# EAGLE design dss_v3 (EAGLE 9.6.0)
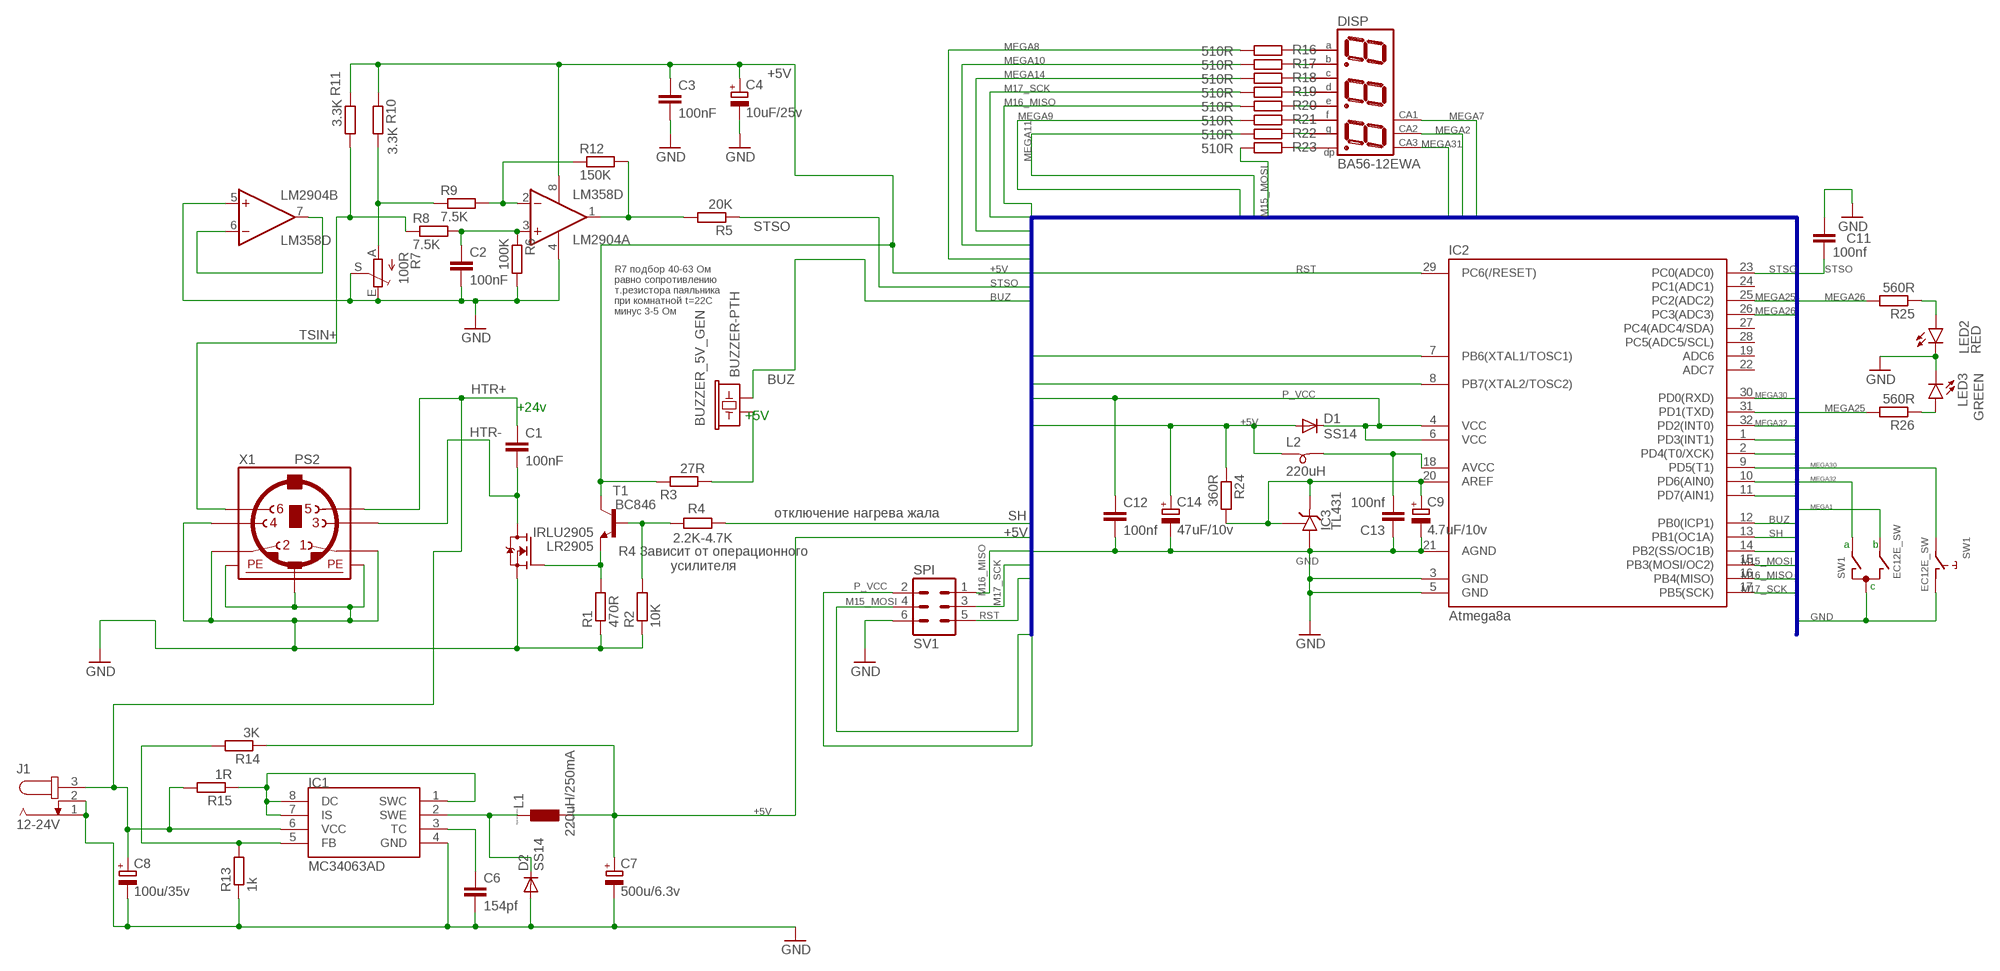
[diagram p0: schematic, sheet 1]

## Parts
BUZZER_5V_GEN  BUZZER-PTH  [BUZZER-12MM]
C1  100nF  C-EUC0805  [C0805]
C2  100nF  C-EUC0805  [C0805]
C3  100nF  C-EUC0805  [C0805]
C4  10uF/25v  CPOL-EUCT3528  [CT3528]
C6  154pf  C-EUC0805  [C0805]
C7  500u/6.3v  CPOL-EUE3.5-8  [E3,5-8]
C8  100u/35v  CPOL-EUE3.5-8  [E3,5-8]
C9  4.7uF/10v  CPOL-EUCT3216  [CT3216]
C11  100nf  C-EUC0805  [C0805]
C12  100nf  C-EUC0805  [C0805]
C13  100nf  C-EUC0805  [C0805]
C14  47uF/10v  CPOL-EUCT3528  [CT3528]
D1  SS14  DIODE-DO214AC  [DO214AC]
D2  SS14  DIODE-DO214AC  [DO214AC]
DISP  BA56-12EWA  [BX56-12]
IC1  MC34063AD  [SOIC8]
IC2  Atmega8a  ATMEGA8-AU  [TQFP32-08]
IC3  TL431  TL431CLPSOT23  [SOT23]
IRLU2905  LR2905  SPW47N60S5  [TO252]
J1  12-24V  JACK-PLUG0  [SPC4077]
L1  220uH/250mA  LL4532P  [L4532P]
L2  220uH  SM-B5  [SM-B5]
LED2  RED  LEDCHIP-LED0805  [CHIP-LED0805]
LED3  GREEN  LEDCHIP-LED0805  [CHIP-LED0805]
LM2904  LM358D  [SO08]
R1  470R  R-EU_R0805  [R0805]
R2  10K  R-EU_R0805  [R0805]
R3  27R  R-EU_R0805  [R0805]
R4  2.2K-4.7K  R-EU_R0805  [R0805]
R5  20K  R-EU_R0805  [R0805]
R6  100K  R-EU_R0805  [R0805]
R7  100R  TRIM_EU-B25P  [B25P]
R8  7.5K  R-EU_R0805  [R0805]
R9  7.5K  R-EU_R0805  [R0805]
R10  3.3K  R-EU_R0805  [R0805]
R11  3.3K  R-EU_R0805  [R0805]
R12  150K  R-EU_R0805  [R0805]
R13  1k  R-EU_R0805  [R0805]
R14  3K  R-EU_R0805  [R0805]
R15  1R  R-EU_R0805  [R0805]
R16  510R  R-EU_R0805  [R0805]
R17  510R  R-EU_R0805  [R0805]
R18  510R  R-EU_R0805  [R0805]
R19  510R  R-EU_R0805  [R0805]
R20  510R  R-EU_R0805  [R0805]
R21  510R  R-EU_R0805  [R0805]
R22  510R  R-EU_R0805  [R0805]
R23  510R  R-EU_R0805  [R0805]
R24  360R  R-EU_R0805  [R0805]
R25  560R  R-EU_R0805  [R0805]
R26  560R  R-EU_R0805  [R0805]
SV1  SPI  ML6  [ML6]
SW1  EC12E_SW  [ALPS_EC12E_SW]
T1  BC846  [SOT23]
X1  PS2  MINI_DIN_6  [M_DIN6]

## Nets
+5V: C3.1 C4.+ C7.+ C14.+ D1.A L1.2 L2.1 LM2904.8(P:V+) R3.2 R10.1 R11.1 R14.1 R24.1 T1.3(C)
BUZ: BUZZER_5V_GEN.- IC2.12(PB0(ICP1))
GND: C2.2 C3.2 C4.- C6.2 C7.- C8.- C9.- C11.1 C12.2 C13.1 C14.- D2.A IC1.4(GND) IC2.3(GND) IC2.5(GND) IC2.21(AGND) IC3.3(A) IRLU2905.3(S) J1.1 J1.2 LED2.C LED3.C LM2904.4(P:V-) LM2904.5(B:+IN) R1.1 R2.1 R6.2 R7.E R7.S R13.1 SV1.6 SW1.C SW1.D X1.1 X1.2 X1.5 X1.SH1(PE1) X1.SH2(PE2) X1.SH3(PE3)
HTR+: C1.1 C8.+ IC1.6(VCC) J1.3 R15.2 X1.6
HTR-: C1.2 IRLU2905.4(D) X1.3
M15_MOSI: IC2.15(PB3(MOSI/OC2)) R23.2 SV1.4
M16_MISO: IC2.16(PB4(MISO)) R20.2 SV1.1
M17_SCK: IC2.17(PB5(SCK)) R19.2 SV1.3
MEGA1: IC2.1(PD3(INT1)) SW1.B
MEGA2: DISP.9(CA) IC2.2(PD4(T0/XCK))
MEGA7: DISP.12(CA) IC2.7(PB6(XTAL1/TOSC1))
MEGA8: IC2.8(PB7(XTAL2/TOSC2)) R16.2
MEGA9: IC2.9(PD5(T1)) R21.2
MEGA10: IC2.10(PD6(AIN0)) R17.2
MEGA11: IC2.11(PD7(AIN1)) R22.2
MEGA14: IC2.14(PB2(SS/OC1B)) R18.2
MEGA25: IC2.25(PC2(ADC2)) R26.2
MEGA26: IC2.26(PC3(ADC3)) R25.2
MEGA30: IC2.30(PD0(RXD)) SW1.E
MEGA31: DISP.8(CA) IC2.31(PD1(TXD))
MEGA32: IC2.32(PD2(INT0)) SW1.A
N$1: DISP.11(A) R16.1
N$2: LED2.A R25.1
N$3: DISP.7(B) R17.1
N$4: DISP.4(C) R18.1
N$5: C9.+ IC2.20(AREF) IC3.1(C) IC3.2(R) R24.2
N$6: LM2904.1(A:OUT) R5.2 R12.2
N$7: LM2904.6(B:-IN) LM2904.7(B:OUT)
N$8: LM2904.2(A:-IN) R9.2 R12.1
N$9: R7.A R9.1 R10.2
N$10: IRLU2905.1(G) R1.2 T1.2(E)
N$11: C2.1 LM2904.3(A:+IN) R6.1 R8.2
N$12: DISP.2(D) R19.1
N$13: R2.2 R4.2 T1.1(B)
N$14: DISP.1(E) R20.1
N$15: LED3.A R26.1
N$16: BUZZER_5V_GEN.+ R3.1
N$18: IC1.5(FB) R13.2 R14.2
N$19: DISP.10(F) R21.1
N$20: DISP.5(G) R22.1
N$21: DISP.3(DP) R23.1
N$22: IC1.1(SWC) IC1.7(IS) IC1.8(DC) R15.1
N$23: C13.2 IC2.18(AVCC) L2.2
N$25: D2.C IC1.2(SWE) L1.1
N$26: C6.1 IC1.3(TC)
P_VCC: C12.1 D1.C IC2.4(VCC) IC2.6(VCC) SV1.2
RST: IC2.29(PC6(/RESET)) SV1.5
SH: IC2.13(PB1(OC1A)) R4.1
STSO: C11.2 IC2.23(PC0(ADC0)) R5.1
TSIN+: R8.1 R11.2 X1.8
Unconnected: IC2.19(ADC6) IC2.22(ADC7) IC2.24(PC1(ADC1)) IC2.27(PC4(ADC4/SDA)) IC2.28(PC5(ADC5/SCL)) SW1.GND1(G) SW1.GND2(G)

## Buses
MEGA[1..32],STSO,BUZ,SH,+5V,GND,AREF,RST,MOSI,SCK,MISO,P_VCC,M15_MOSI,M16_MISO,M17_SCK

## Notes on the sheet
- R7 подбор 40-63 Ом
  равно сопротивлению
  т.резистора паяльника
  при комнатной t=22С
  минус 3-5 Ом
- +24v
- +5V
- отключение нагрева жала
- a | b
- R4 Зависит от операционного
               усилителя
- c

## Library data of the parts
BUZZER_5V_GEN = SparkFun-Electromechanical:BUZZER: Buzzer Small round buzzers that operate around the audible 2kHz range. You can use these as speakers to create simple music or user interfaces. Variant Overview: PTH - Mini Speaker - PC Mount 12mm 2.048kHz <https://www.sparkfun.com/products/7950> PTH_KIT - Mini Speaker - PC Mount 12mm 2.048kHz <https://www.sparkfun.com/products/7950> KIT simplifies soldering by adding stop mask to one side of the pads. PTH_NO_SILK - Mini Speaker - PC Mount 12mm 2.048kHz <https://www.sparkfun.com/products/7950> No silkscreen indicator of buzzer outline. PTH_KIT_NO_SILK - Mini Speaker - PC Mount 12mm 2.048kHz <https://www.sparkfun.com/products/7950> KIT package w/o silkscreen SMD - Buzzer Audio Magnetic (CCV-084B16) SMD buzzer used on, e.g. the LilyPad Buzzer <https://www.sparkfun.com/products/8463> and RFID USB Reader <https://www.sparkfun.com/products/9963>. SMD_KIT - Buzzer Audio Magnetic (CCV-084B16) SMD Buzzer with elongated pins to make soldering easier. Used on the SparkFun Simon Says - Surface Mount Soldering Kit <https://www.sparkfun.com/products/10935>.; PROD_ID: COMP-08253; SF_SKU: COM-07950
C1-C3 C6 C11-C13 = rcl:C-EU: CAPACITOR, European symbol
C4 C9 C14 = rcl:CPOL-EU: POLARIZED CAPACITOR, European symbol; SPICEPREFIX: C
C7 C8 = rcl:CPOL-EU: POLARIZED CAPACITOR, European symbol
D1 D2 = diode:DIODE-: DIODE
DISP = 3DIG_7SEG:B?56-12*WA: 9.2mm THREE DIGIT NUMERIC DISPLAY Source: http://www.kosmodrom.com.ua/pdf/E30361-LI.pdf; OC_FARNELL: unknown; OC_NEWARK: unknown
IC1 = mc34063:MC34063
IC2 = atmega8:ATMEGA8
IC3 = v-reg:TL431CLP: VOLTAGE REGULATOR
IRLU2905 = transistor-fet:SPW47N60S5: Cool MOS Power Transistor
J1 = con-jack:JACK-PLUG: DC POWER JACK Power Jack, DC, Right Angle, Through Hole, Rated 5A at 16VDC, PC Terminals Distributor: Farnell (www.Farnell.de) Drawing: 84N1161.pdf / 84N1162.pdf Manufacturer: SPC Technology (www.spctechnology.com) Type: SPC4077 / SPC 4078; OC_FARNELL: unknown; OC_NEWARK: unknown
L1 = eagle-ltspice:L: INDUCTOR, European symbol; SPICEMODEL: NONE; SPICEPREFIX: L
L2 = inductor-neosid:SM-B: INDUCTOR SMD Bead inductor; OC_FARNELL: unknown; OC_NEWARK: unknown
LED2 LED3 = led:LED: LED OSRAM: - CHIPLED LG R971, LG N971, LY N971, LG Q971, LY Q971, LO R971, LY R971 LH N974, LH R974 LS Q976, LO Q976, LY Q976 LO Q996 - Hyper CHIPLED LW Q18S LB Q993, LB Q99A, LB R99A - SideLED LS A670, LO A670, LY A670, LG A670, LP A670 LB A673, LV A673, LT A673, LW A673 LH A674 LY A675 LS A676, LA A676, LO A676, LY A676, LW A676 LS A679, LY A679, LG A679 - Hyper Micro SIDELED® LS Y876, LA Y876, LO Y876, LY Y876 LT Y87S - SmartLED LW L88C, LW L88S LB L89C, LB L89S, LG L890 LS L89K, LO L89K, LY L89K LS L896, LA L896, LO L896, LY L896 - TOPLED LS T670, LO T670, LY T670, LG T670, LP T670 LSG T670, LSP T670, LSY T670, LOP T670, LYG T670 LG T671, LOG T671, LSG T671 LB T673, LV T673, LT T673, LW T673 LH T674 LS T676, LA T676, LO T676, LY T676, LB T676, LH T676, LSB T676, LW T676 LB T67C, LV T67C, LT T67C, LS T67K, LO T67K, LY T67K, LW E67C LS E67B, LA E67B, LO E67B, LY E67B, LB E67C, LV E67C, LT E67C LW T67C LS T679, LY T679, LG T679 LS T770, LO T770, LY T770, LG T770, LP T770 LB T773, LV T773, LT T773, LW T773 LH T774 LS E675, LA E675, LY E675, LS T675 LS T776, LA T776, LO T776, LY T776, LB T776 LHGB T686 LT T68C, LB T68C - Hyper Mini TOPLED® LB M676 - Mini TOPLED Santana® LG M470 LS M47K, LO M47K, LY M47K Source: http://www.osram.convergy.de LUXEON: - LUMILED® LXK2-PW12-R00, LXK2-PW12-S00, LXK2-PW14-U00, LXK2-PW14-V00 LXK2-PM12-R00, LXK2-PM12-S00, LXK2-PM14-U00 LXK2-PE12-Q00, LXK2-PE12-R00, LXK2-PE12-S00, LXK2-PE14-T00, LXK2-PE14-U00 LXK2-PB12-K00, LXK2-PB12-L00, LXK2-PB12-M00, LXK2-PB14-N00, LXK2-PB14-P00, LXK2-PB14-Q00 LXK2-PR12-L00, LXK2-PR12-M00, LXK2-PR14-Q00, LXK2-PR14-R00 LXK2-PD12-Q00, LXK2-PD12-R00, LXK2-PD12-S00 LXK2-PH12-R00, LXK2-PH12-S00 LXK2-PL12-P00, LXK2-PL12-Q00, LXK2-PL12-R00 Source: www.luxeon.com KINGBRIGHT: KA-3528ASYC Source: www.kingbright.com
LM2904 = linear:LM358: OP AMP also LM158; LM258; LM2904 Source: http://cache.national.com/ds/LM/LM158.pdf
R1 R16-R23 R25 R26 = rcl:R-EU_: RESISTOR, European symbol; SPICEPREFIX: R
R2-R6 R8-R15 R24 = rcl:R-EU_: RESISTOR, European symbol
R7 = pot:TRIM_EU-: POTENTIOMETER
SV1 = con-ml:ML6: HARTING; OC_FARNELL: unknown; OC_NEWARK: unknown
SW1 = switch-alps:EC12E_SW: ALPS rotary Encoder EC12E series with switch; MPN: EC12E2424407; OC_FARNELL: 1520813; OC_NEWARK: 74M1068
T1 = transistor-neu-to92:BC846: NPN TRANSISTOR
X1 = mini_din:MINI_DIN_6

## Board
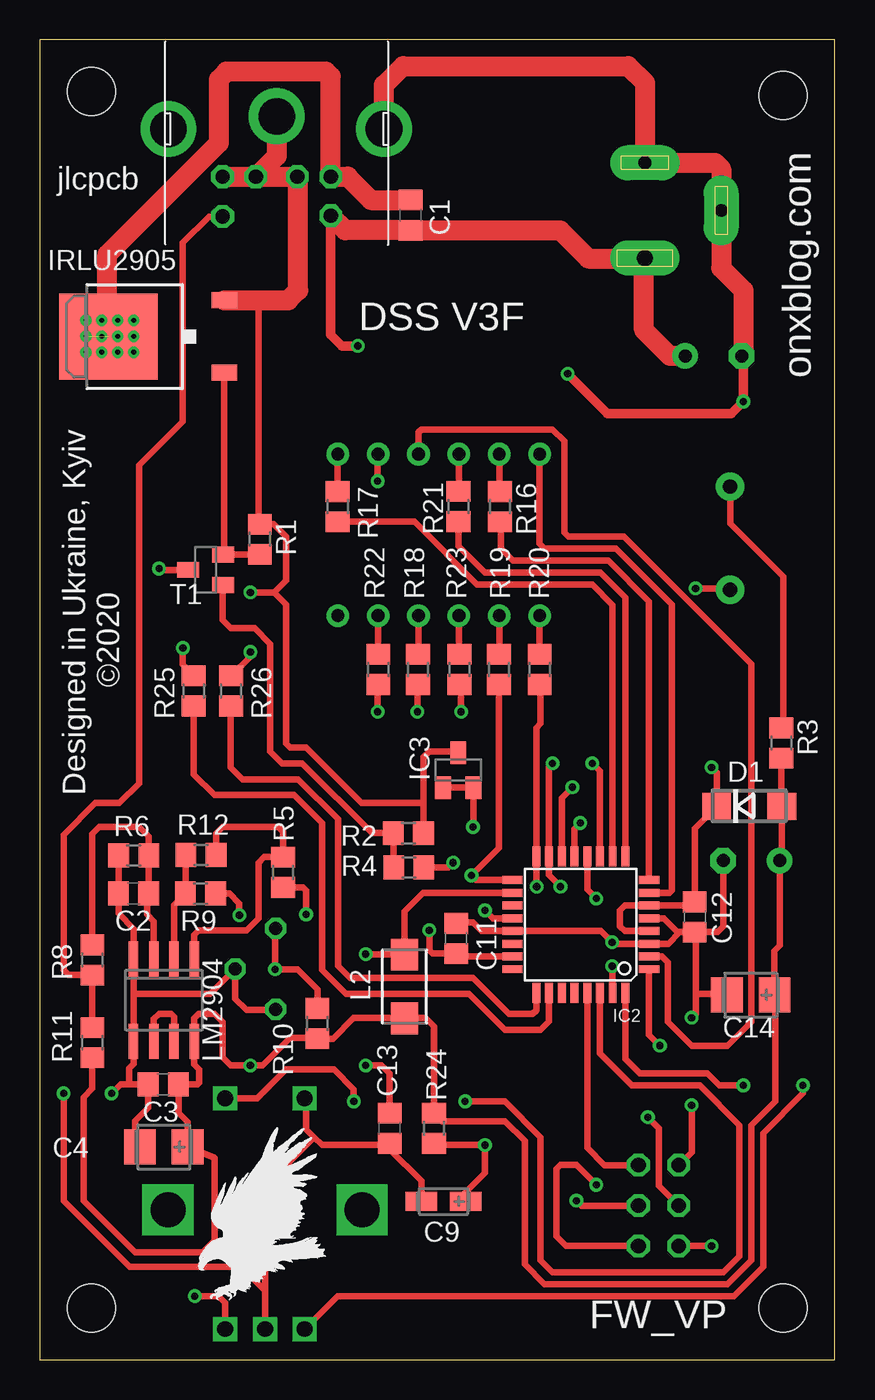
[diagram p1: board, top side]
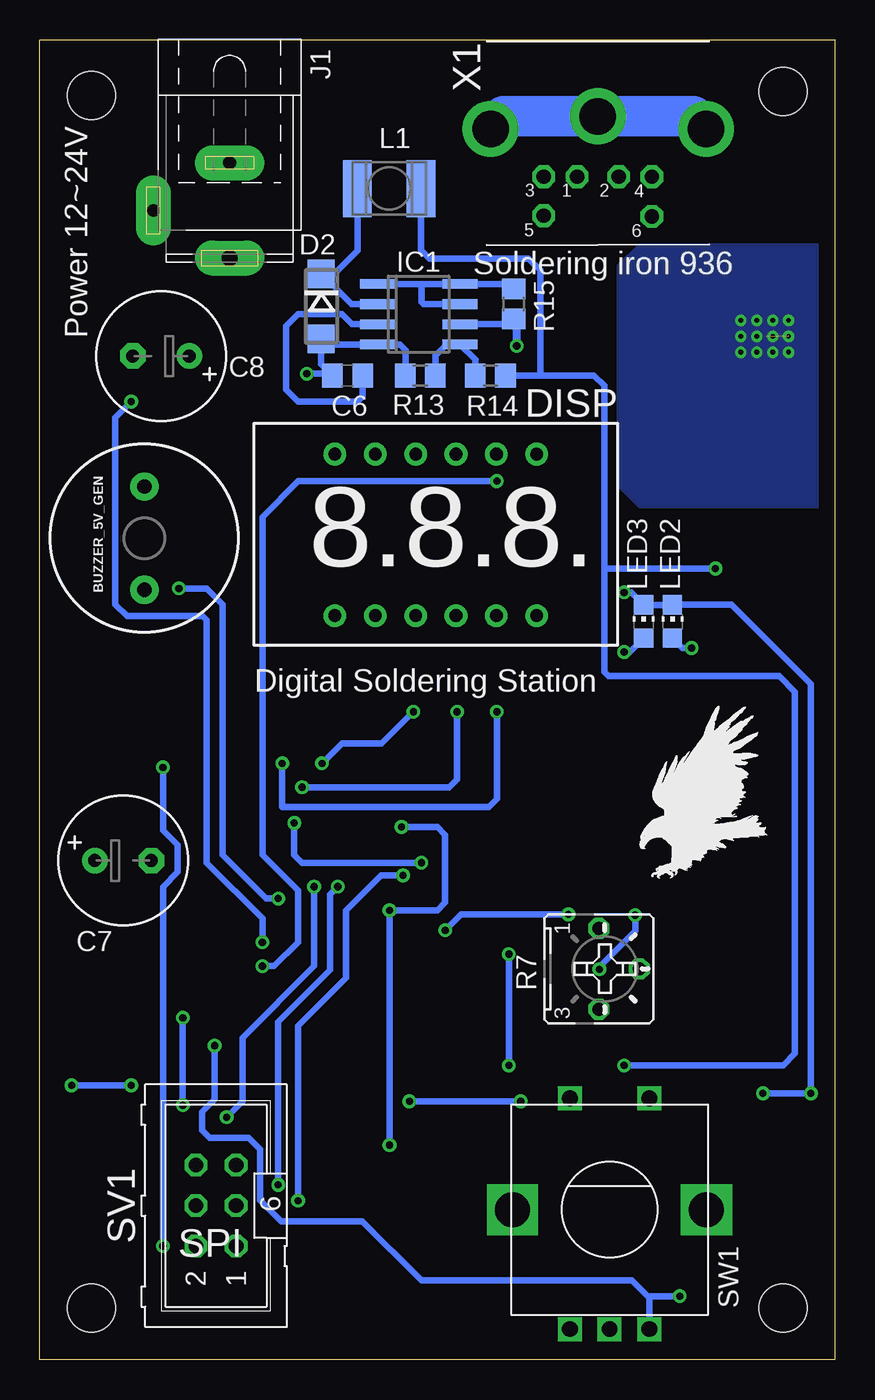
[diagram p2: board, bottom side, seen from below]

Size 50 x 83 mm. Coordinates in mm from the lower left corner, seen from the top.
Outline: 0,0 50,0 50,83 0,83 0,0
Copper layers (1*16): Top 0.035mm / dielectric 1.5mm / Bottom 0.035mm
Design rules "default": minimum track width 6mil, minimum drill 0.35mm, track to track 6mil, track to pad 6mil, pad to pad 6mil, via to via 6mil, smd to smd 6mil, copper to edge 40mil, drill to drill 6mil, minimum pad ring 10mil, minimum via ring 8mil, stop-mask expansion 4mil, vias tented up to drill 0mil, thermal gap 10mil
Holes 3 mm at 3.25,79.75 46.75,79.5 3.25,3.25 46.75,3.25

### Footprints (pad centres in the part's own frame; a part is rotated, then mirrored left to right if it is on the bottom)
BUZZER-12MM = drill 0.9 pad 1.778: + 3.25,0; - -3.25,0
C0805 = smd 1.3 x 1.5: 1 -0.95,0; 2 0.95,0
CT3528 = smd 2 x 2.2: + -1.5,0; - 1.5,0
E3,5-8 = drill 0.813 pad 1.6: + -1.778,0 | drill 0.813 pad 1.6 octagon: - 1.778,0
CT3216 = smd 2 x 1.2: + -1.4,0; - 1.4,0
DO214AC = smd 1.8 x 1.7: A 2.05,0; C -2.05,0
BX56-12 = drill 0.8 pad 1.422: 1 -6.35,-5.08; 2 -3.81,-5.08; 3 -1.27,-5.08; 4 1.27,-5.08; 5 3.81,-5.08; 6 6.35,-5.08; 7 6.35,5.08; 8 3.81,5.08; 9 1.27,5.08; 10 -1.27,5.08; 11 -3.81,5.08; 12 -6.35,5.08
SOIC8 = smd 0.6 x 2.2: 1 -1.905,-2.6; 2 -0.635,-2.6; 3 0.635,-2.6; 4 1.905,-2.6; 5 1.905,2.6; 6 0.635,2.6; 7 -0.635,2.6; 8 -1.905,2.6
TQFP32-08 = smd 1.27 x 0.5: 1 -4.293,2.8; 2 -4.293,2; 3 -4.293,1.2; 4 -4.293,0.4; 5 -4.293,-0.4; 6 -4.293,-1.2; 7 -4.293,-2; 8 -4.293,-2.8; 17 4.293,-2.8; 18 4.293,-2; 19 4.293,-1.2; 20 4.293,-0.4; 21 4.293,0.4; 22 4.293,1.2; 23 4.293,2; 24 4.293,2.8 | smd 0.5 x 1.27: 9 -2.8,-4.293; 10 -2,-4.293; 11 -1.2,-4.293; 12 -0.4,-4.293; 13 0.4,-4.293; 14 1.2,-4.293; 15 2,-4.293; 16 2.8,-4.293; 25 2.8,4.293; 26 2,4.293; 27 1.2,4.293; 28 0.4,4.293; 29 -0.4,4.293; 30 -1.2,4.293; 31 -2,4.293; 32 -2.8,4.293
SOT23 = smd 1 x 1.4: 1 -0.95,-1.1; 2 0.95,-1.1; 3 0,1.1
TO252 = smd 1 x 1.6: 1 -2.28,-4.8; 3 2.28,-4.8 | smd 5.4 x 6.2: 4 0,2.5
SPC4077 = drill 0.8 pad 2.184 long: 1 -3,0; 2 0,-4.8 | drill 1 pad 2.184 long: 3 3,0
L4532P = smd 1.8 x 3.6: 1 -2,0; 2 2,0
SM-B5 = smd 2 x 1.7: 1 -2,0; 2 2,0
CHIP-LED0805 = smd 1.2 x 1.2: A 0,-1.05; C 0,1.05
SO08 = smd 0.6 x 2.2: 1 -1.905,-2.6; 2 -0.635,-2.6; 3 0.635,-2.6; 4 1.905,-2.6; 5 1.905,2.6; 6 0.635,2.6; 7 -0.635,2.6; 8 -1.905,2.6
R0805 = smd 1.3 x 1.5: 1 -0.95,0; 2 0.95,0
B25P = drill 0.813 octagon: A -2.54,0; E 2.54,0; S 0,2.54
ML6 = drill 0.914 octagon: 1 -2.54,-1.27; 2 -2.54,1.27; 3 0,-1.27; 4 0,1.27; 5 2.54,-1.27; 6 2.54,1.27
ALPS_EC12E_SW = drill 1 square: A -2.5,-7.5; B 2.5,-7.5; C 0,-7.5; D -2.5,7; E 2.5,7 | drill 2.2 square: GND1 -6.1,0; GND2 6.1,0
M_DIN6 = drill 0.9 pad 1.422 octagon: 1 -1.3,-3.75; 2 1.3,-3.75; 3 -3.4,-3.75; 5 3.4,-3.75; 6 -3.4,-6.2; 8 3.4,-6.25 | drill 2.3 pad 3.5: SH1 6.8,-0.75; SH2 0,0.05; SH3 -6.75,-0.75

### Placement (x,y rotation side)
BUZZER_5V_GEN  43.42,51.66 90 bottom
C1  23.31,71.97 90 top
C2  5.9,29.31 180 top
C3  7.77,17.31 180 top
C4  7.8,13.38 180 top
C6  30.64,61.89 180 bottom
C7  44.76,31.39 0 bottom
C8  42.37,63.11 180 bottom
C9  25.39,9.95 180 top
C11  26.19,26.49 270 top
C12  41.19,27.84 270 top
C13  22.01,14.56 90 top
C14  44.71,22.93 180 top
D1  44.62,34.8 0 top
D2  32.3,66.23 270 bottom
DISP  25.09,51.87 0 bottom
IC1  26.17,65.74 270 bottom
IC2  34.03,27.36 180 top
IC3  26.32,37.07 0 top
IRLU2905  6.81,64.34 90 top
J1  38.06,72.27 270 bottom
L1  28.02,73.64 0 bottom
L2  22.93,23.47 90 top
LED2  10.2,46.42 0 bottom
LED3  12.02,46.42 0 bottom
LM2904  7.81,22.61 180 top
R1  13.84,51.59 270 top
R2  23.19,33.11 180 top
R3  46.64,38.77 270 top
R4  4.7K  [R0805]  23.21,30.96 180 top
R5  15.31,30.65 90 top
R6  5.91,31.71 180 top
R7  14.84,24.58 270 bottom
R8  3.31,25.14 90 top
R9  10.11,29.31 180 top
R10  17.46,21.14 90 top
R11  3.31,19.94 90 top
R12  10.14,31.74 0 top
R13  26.07,61.89 0 bottom
R14  21.66,61.89 180 bottom
R15  20.19,66.39 270 bottom
R16  28.94,53.64 270 top
R17  18.74,53.64 270 top
R18  23.79,43.41 270 top
R19  28.89,43.41 270 top
R20  31.44,43.41 270 top
R21  26.34,53.66 270 top
R22  21.29,43.41 270 top
R23  26.39,43.41 270 top
R24  24.79,14.56 270 top
R25  9.69,42.06 270 top
R26  12.04,42.06 270 top
SV1  38.92,9.69 90 bottom
SW1  14.16,9.43 0 bottom
T1  10.43,49.67 90 top
U$1  [EAGLE-PLC-8MM]  10,3.75 0 top
U$3  [EAGLE-PLC-8MM]  12.25,30.25 0 bottom
X1  14.9,78.14 0 bottom

### Tracks (layer width: path | path; a pad name or v marks a point on that pad's centre or on a via)
+5V  (via drill 0.45)
  Top 0.406: 8.78,17.25 C3.1 | R11.1 3.31,17.06 2.75,16.5 2.75,10 6,6.75 10.25,6.75 11,7.5 11,12.68 C4.+ 9.3,14.95 8.72,15.53 C3.1 | T1.3 7.58,49.67 v7.5,49.75 | R3.2 46.64,34.83 D1.A 46.67,31.52 C7.+ 46.54,26.04 46.21,25.71 C14.+ 46.25,22.89 46.25,16.25 44.75,14.75 44.75,6.25 43.25,4.75 31.75,4.75 30.5,6 30.5,13.75 29.25,15 25.3,15 R24.1 24.79,20.96 24.25,21.5 22.9,21.5 | 22.9,21.5 19.75,21.5 18.44,20.19 R10.1 | 22.9,21.5 L2.1 | 17.5,20.15 R10.1 | R10.1 17.4,20.25 15.75,20.25 14,18.5 v13.25,18.5 12,18.5 11.5,19 11.5,21.25 11,21.75 10,21.75 9.71,21.46 LM2904.8 9.71,18.57 10.03,18.25 10.03,17.41 9.93,17.31 C3.1
  Bottom 0.406: R14.1 18.61,61.89 | 18.61,61.89 18.5,62 18.5,68.5 19.25,69.25 25.5,69.25 26.02,69.77 L1.2 | v13.25,18.5 3.25,18.5 2.5,19.25 2.5,42 3.5,43 14.25,43 14.5,43.25 14.5,49.75 | 14.5,49.75 14.5,61.25 15.14,61.89 18.61,61.89 | v7.5,49.75 14.5,49.75
BUZ  (via drill 0.45)
  Top 0.406: v41.25,48.5 43.33,48.5 BUZZER_5V_GEN.- | IC2.12 34.43,29.57 v35,29
  Bottom 0.406: v35,29 35.75,29 38.5,31.75 38.5,47.5 39.5,48.5 v41.25,48.5
GND  (via drill 0.45)
  Top 0.406: 6.76,17.25 C3.2 | 5.91,23 LM2904.4 5.91,27.09 4.95,28.05 C2.2 R6.2 | 5.91,23 LM2904.5 5.91,18.61 5.61,18.31 5.61,17.39 5.69,17.31 C3.2 | C3.2 6.75,17.24 | 5.91,23 10.72,23 R7.S 12.3,22.7 13,22 14.8,22 R7.E | v1.5,16.75 1.5,10 5.65,5.85 12.65,5.85 14.16,4.34 | 14.75,48.25 15.5,49 15.5,51.75 14.71,52.54 R1.1 13.75,52.63 13.75,66.62 | 14.75,48.25 v13.25,48.25 | C12.2 41.25,26.83 41.25,23 | IC2.5 39.24,27.76 40.11,26.89 40.25,26.89 | 40.25,26.89 C12.2 | C12.2 42.64,26.89 43,27.25 43,31.37 C7.- | 14.75,48.25 15.5,47.5 15.5,38.75 15.75,38.5 16.75,38.5 20.25,35 24.14,35 R2.1 24.14,37.89 24.5,38.25 26.24,38.25 IC3.3 | C11.1 26.25,27.5 27.25,27.5 27.79,26.96 IC2.21 35.29,26.96 v36,26.25 36.09,26.16 IC2.3 39.52,26.16 40.25,26.89 | 23.97,9.93 C9.- | C9.- 24.01,9.97 | v41,16 41,13.04 SV1.6 | C4.- 6,13.46 6,15.02 6.82,15.84 C3.2 | 17.25,14 16.75,14.5 16.75,16.34 SW1.D 16.64,16.45 | 17.25,14 17.75,13.5 21.9,13.5 C13.1 | C13.1 | SW1.C 14.16,4.34 | 14.16,4.34 14.16,10.91 17.25,14 | v41,21.5 41.25,21.75 41.25,23 | 41.25,23 43.14,23 C14.- | C13.1 22.01,13.24 24,11.25 C9.- | v4.52,16.75 5.08,17.31 C3.2
  Top 0.61: v33.2,62 35.7,59.5 43.5,59.5 v44.25,60.25 44.25,63.21
  Top 1.27: X1.5 X1.2 | X1.2 X1.1 16.25,74.34 16.25,67.25 15.62,66.62 13.75,66.62 IRLU2905.3 | X1.SH2 14.9,75.69 X1.2 | C8.- 44.25,63.21 44.25,67.25 42.86,68.64 J1.2 42.86,74.89 42.48,75.27 J1.1 38.06,80.29 37,81.35 22.85,81.35 21.65,80.15 X1.SH3
  Bottom 0.406: R13.1 27,61.91 27,63.5 27.34,63.84 IC1.4 31.95,63.84 D2.A 32.3,62.6 C6.2 31.7,62 v33.2,62 | v4.52,16.75 v1.5,16.75 1.5,42.5 6.5,47.5 10.22,47.5 10.25,47.47 | LED2.C 10.25,47.47 | 10.25,47.47 LED3.C 12.8,48.25 v13.25,48.25 | v36,26.25 36,27.75 39.5,31.25 39.5,46.5 39.75,46.75 44.5,46.75 45.25,47.5 45.25,59.25 v44.25,60.25 | v41,21.5 v41,16
  Bottom 2.54: X1.SH1 8.9,78.19 X1.SH2 20.85,78.19 X1.SH3
HTR+  (via drill 0.45)
  Top 0.61: X1.6 18.3,64.45 19,63.75 v20,63.75
  Top 1.27: 38.04,69.25 34.5,69.25 32.73,71.02 C1.1 19.22,71.02 X1.6 | 38.04,69.25 J1.3 | C8.+ 39.64,63.11 38,64.75 38,69.21 38.04,69.25
  Bottom 0.406: IC1.6 20.52,65.11 R15.2 20,65.25
  Bottom 0.508: v20,63.75 20,65.25
HTR-  (via drill 0.3)  (1 unrouted)
  Top 1.27: IRLU2905.4 4.25,64.4 4.25,69.5 11.25,76.5 11.25,80.5 11.75,81 18,81 18.3,80.7 X1.3 19.36,74.39 20.83,72.92 C1.2
  other vias: 5.9,63.35 3.9,64.35 4.9,63.35 3.9,63.35 2.9,63.35 5.9,65.35 4.9,65.35 3.9,65.35 5.9,64.35 4.9,64.35 2.9,64.35 2.9,65.35
  pour Bottom: 0,70 12.25,70 13.5,68.75 13.5,55 12.25,53.75 0,53.75
M15_MOSI  (via drill 0.45)
  Top 0.406: v26.5,40.75 26.5,42.35 R23.2 | v32.25,37.5 32.03,37.28 IC2.15 32.03,30.47 v32.75,29.75 | v38.25,15.25 38.95,14.55 38.95,10.93 SV1.4
  Bottom 0.406: v26.5,40.75 28.5,38.75 31,38.75 v32.25,37.5 | v32.75,29.75 32.75,24.75 37.25,20.25 37.25,16.25 v38.25,15.25
M16_MISO  (via drill 0.45)
  Top 0.406: R20.2 31.5,42.4 31.5,40 31.23,39.73 IC2.16 31.25,31.63 v31.25,29.75 | SV1.1 33.1,7.15 32.5,7.75 32.5,12 32.75,12.25 33.75,12.25 v35,11
  Bottom 0.406: v31.25,29.75 31.75,29.25 31.75,24.5 35,21.25 v35,11
M17_SCK  (via drill 0.45)
  Top 0.406: 28.59,30.16 IC2.17 27.44,30.16 v27.15,30.45 28.89,32.19 R19.2 | SV1.3 34.06,9.69 v33.75,10
  Bottom 0.406: v33.75,10 33.75,21 30.75,24 30.75,28.25 28.55,30.45 v27.15,30.45
MEGA1  (via drill 0.45)
  Top 0.406: IC2.1 38.32,20.43 v39,19.75 | SW1.B 11.66,3.59 11.25,4 v9.75,4
  Bottom 0.406: v39,19.75 39,16.36 39.78,15.57 39.78,14.43 39.33,13.97 36.88,13.97 36.13,13.22 36.13,10.03 34.83,8.72 29.72,8.72 26,5 12.75,5 11.66,3.91 | SW1.B 11.66,3.91 | 11.66,3.91 11.57,4 v9.75,4
MEGA2
  Top 0.406: DISP.9 23.82,58.32 24,58.5 32.25,58.5 33,57.75 33,52 33.25,51.75 36.75,51.75 44.75,43.75 44.75,21.25 43.25,19.75 41,19.75 39.5,21.25 39.5,25 39.14,25.36 IC2.2
MEGA7
  Top 0.406: DISP.12 31.44,51.31 31.75,51 36.25,51 39.75,47.5 39.75,29.5 39.61,29.36 IC2.7
MEGA8
  Top 0.406: R16.2 29,52.63 29,51 29.75,50.25 35.75,50.25 38.32,47.68 IC2.8
MEGA9
  Top 0.406: R21.2 26.34,51.16 28,49.5 35.25,49.5 36.83,47.92 IC2.9
MEGA10
  Top 0.406: R17.2 23.56,52.69 27.5,48.75 34.75,48.75 36.03,47.47 IC2.10
MEGA11  (via drill 0.45)
  Top 0.406: v21.25,40.75 21.25,42.42 R22.2 | IC2.11 35.23,37.02 v34.75,37.5
  Bottom 0.406: v34.75,37.5 34.75,34.75 21.75,34.75 21.25,35.25 v21.25,40.75
MEGA14  (via drill 0.45)
  Top 0.406: v23.75,40.75 23.75,42.42 R18.2 | IC2.14 32.83,35.33 v33.5,36
  Bottom 0.406: v33.5,36 24.25,36 23.75,36.5 v23.75,40.75
MEGA25
  Top 0.406: IC2.25 31.23,21.98 31,21.75 29.5,21.75 27.25,24 19.5,24 18.75,24.75 18.75,34 16.25,36.5 12.75,36.5 12,37.25 12,41.07 R26.2
MEGA26
  Top 0.406: IC2.26 32.03,21.28 31.5,20.75 29.25,20.75 27,23 19.25,23 17.75,24.5 17.75,33.75 16,35.5 11,35.5 9.69,36.81 R25.2
MEGA30  (via drill 0.45)
  Top 0.406: IC2.30 35.23,19.27 37.25,17.25 41.5,17.25 44,14.75 44,6.5 43,5.5 32.25,5.5 31.5,6.25 31.5,14 29.25,16.25 v26.75,16.25 | SW1.E 13.68,16.43 15.5,18.25 18.5,18.25 19.75,17 v19.75,16.25
  Bottom 0.406: v19.75,16.25 v26.75,16.25
MEGA31  (via drill 0.45)
  Top 0.406: DISP.8 21.25,56.92 v21.25,55.25 | IC2.31 36,23.1 v36,24.75
  Bottom 0.406: v36,24.75 35.25,24.75 33.75,26.25 33.75,29.5 36,31.75 36,53 33.75,55.25 v21.25,55.25
MEGA32  (via drill 0.45)
  Top 0.406: v44.25,17.25 42.75,17.25 42,18 37.75,18 36.83,18.92 IC2.32 | SW1.A 18.73,4 43.65,4 45.5,5.85 45.5,14.25 48,16.75 v48,17.25
  Bottom 0.406: v44.25,17.25 v48,17.25
N$1
  Top 0.406: DISP.11 28.9,54.63 R16.1
N$2  (via drill 0.45)
  Top 0.406: R25.1 9,43.7 v9,44.75
  Bottom 0.406: LED2.A 9.58,44.75 v9,44.75
N$3
  Top 0.406: DISP.7 R17.1
N$4
  Top 0.406: DISP.4 23.82,44.39 R18.1
N$5  (via drill 0.45)
  Top 0.406: IC2.20 28.49,27.76 v28,28.25 | v27.25,33.5 27.27,33.52 IC3.2 IC3.1 | R24.2 24.9,13.5 v28,13.5 28,11.75 26.79,10.54 C9.+
  Bottom 0.406: v27.25,33.5 25,33.5 24.5,33 24.5,28.75 25,28.25 v28,28.25 v28,13.5
N$6
  Top 0.406: 9.75,25.25 LM2904.1 9.71,26.71 10,27 13,27 13.75,27.75 13.75,31.25 14.1,31.6 R5.2 15.31,33.19 15,33.5 11.5,33.5 11.09,33.09 R12.2
N$7
  Top 0.406: LM2904.7 8.45,21.55 8.25,21.75 7.5,21.75 7.17,21.43 LM2904.6
N$8
  Top 0.406: LM2904.2 8.45,28.59 R9.2 9.19,29.34 R12.1
N$9  (via drill 0.45)
  Top 0.406: R9.1 11.94,29.31 12.55,28.7 v12.55,27.95 | R10.2 17.46,23.29 16.2,24.55 v14.8,24.55 14.8,27.08 R7.A
  Bottom 0.406: v12.55,27.95 12.55,26.95 14.8,24.7 v14.8,24.55
N$10
  Top 0.406: IRLU2905.1 11.61,50.7 T1.2 13.82,50.62 R1.2
N$11
  Top 0.406: LM2904.3 7.17,27.57 6.75,28 6.75,29.21 C2.1 R6.1 6.86,32.89 6.25,33.5 3.75,33.5 3.31,33.06 R8.2
N$12
  Top 0.406: DISP.2 R19.1
N$13
  Top 0.406: T1.1 11.5,48.69 11.5,46.5 12,46 13.5,46 14.5,45 14.5,38.25 15.25,37.5 16.5,37.5 20.89,33.11 R2.2 22.26,33.09 R4.2
N$14
  Top 0.406: DISP.1 R20.1
N$15  (via drill 0.45)
  Top 0.406: R26.1 13.25,44.22 v13.25,44.5
  Bottom 0.406: LED3.A 12.89,44.5 v13.25,44.5
N$16
  Top 0.406: BUZZER_5V_GEN.+ 43.42,52.58 46.75,49.25 46.75,39.83 R3.1
N$18
  Bottom 0.406: R14.2 22.61,62.88 IC1.5 24.41,63.84 25.12,63.13 R13.2
N$19
  Top 0.406: DISP.10 26.36,54.63 R21.1
N$20
  Top 0.406: DISP.5 R22.1
N$21
  Top 0.406: DISP.3 26.36,44.39 R23.1
N$22
  Bottom 0.406: 26,67.64 IC1.8 20.5,67.64 R15.1 | 26,67.64 IC1.1 | IC1.7 25.88,66.38 26,66.5 26,67.64
N$23  (via drill 0.45)
  Top 0.406: IC2.18 24.11,29.36 22.93,28.18 L2.2 22.9,25.5 v20.5,25.5 | C13.2 22,18 21.5,18.5 v20.5,18.5
  Bottom 0.406: v20.5,25.5 v20.5,18.5
N$25
  Bottom 0.406: IC1.2 30.38,66.38 32.28,68.28 D2.C 31.47,68.28 30.02,69.73 L1.1
N$26
  Bottom 0.406: C6.1 29.69,60.56 30,60.25 33.75,60.25 34.5,61 34.5,65 33.75,65.75 31,65.75 30.36,65.11 IC1.3
P_VCC  (via drill 0.45)
  Top 0.406: IC2.4 36.79,26.96 36.5,27.25 36.5,28.25 36.81,28.56 IC2.6 40.96,28.56 C12.1 41.19,33.42 D1.C | 43,35 42.8,34.8 D1.C | SV1.2 v42.25,7.15 | v42.25,37.25 42.57,36.93 D1.C
  Bottom 0.406: v42.25,37.25 42.25,33.29 41.33,32.37 41.33,30.66 42.25,29.74 v42.25,7.15
RST
  Top 0.406: SV1.5 35.52,12.23 34.43,13.32 IC2.29
SH  (via drill 0.45)
  Top 0.406: 24.45,31.25 R4.1 25.71,30.96 v26,31.25 | IC2.13 33.63,33.38 v34,33.75
  Bottom 0.406: v26,31.25 33.5,31.25 34,31.75 v34,33.75
STSO  (via drill 0.45)
  Top 0.406: IC2.23 26.37,25.36 C11.2 24.71,25.54 24.5,25.75 v24.5,27 | 15.36,29.75 R5.1 16.55,29.7 16.75,29.5 v16.75,28
  Bottom 0.406: v24.5,27 23.5,28 v16.75,28
TSIN+
  Top 0.406: R11.2 R8.1 1.81,24.19 1.5,24.5 1.5,33 3.5,35 5,35 6.25,36.25 6.25,56.25 9,59 9,70.25 10.64,71.89 X1.8

### Text on the board
tPlace: jlcpcb | DSS V3F | onxblog.com | Designed in Ukraine, Kyiv / ©2020 | FW_VP
bPlace: Soldering iron 936 | Power 12~24V | Digital Soldering Station | SPI